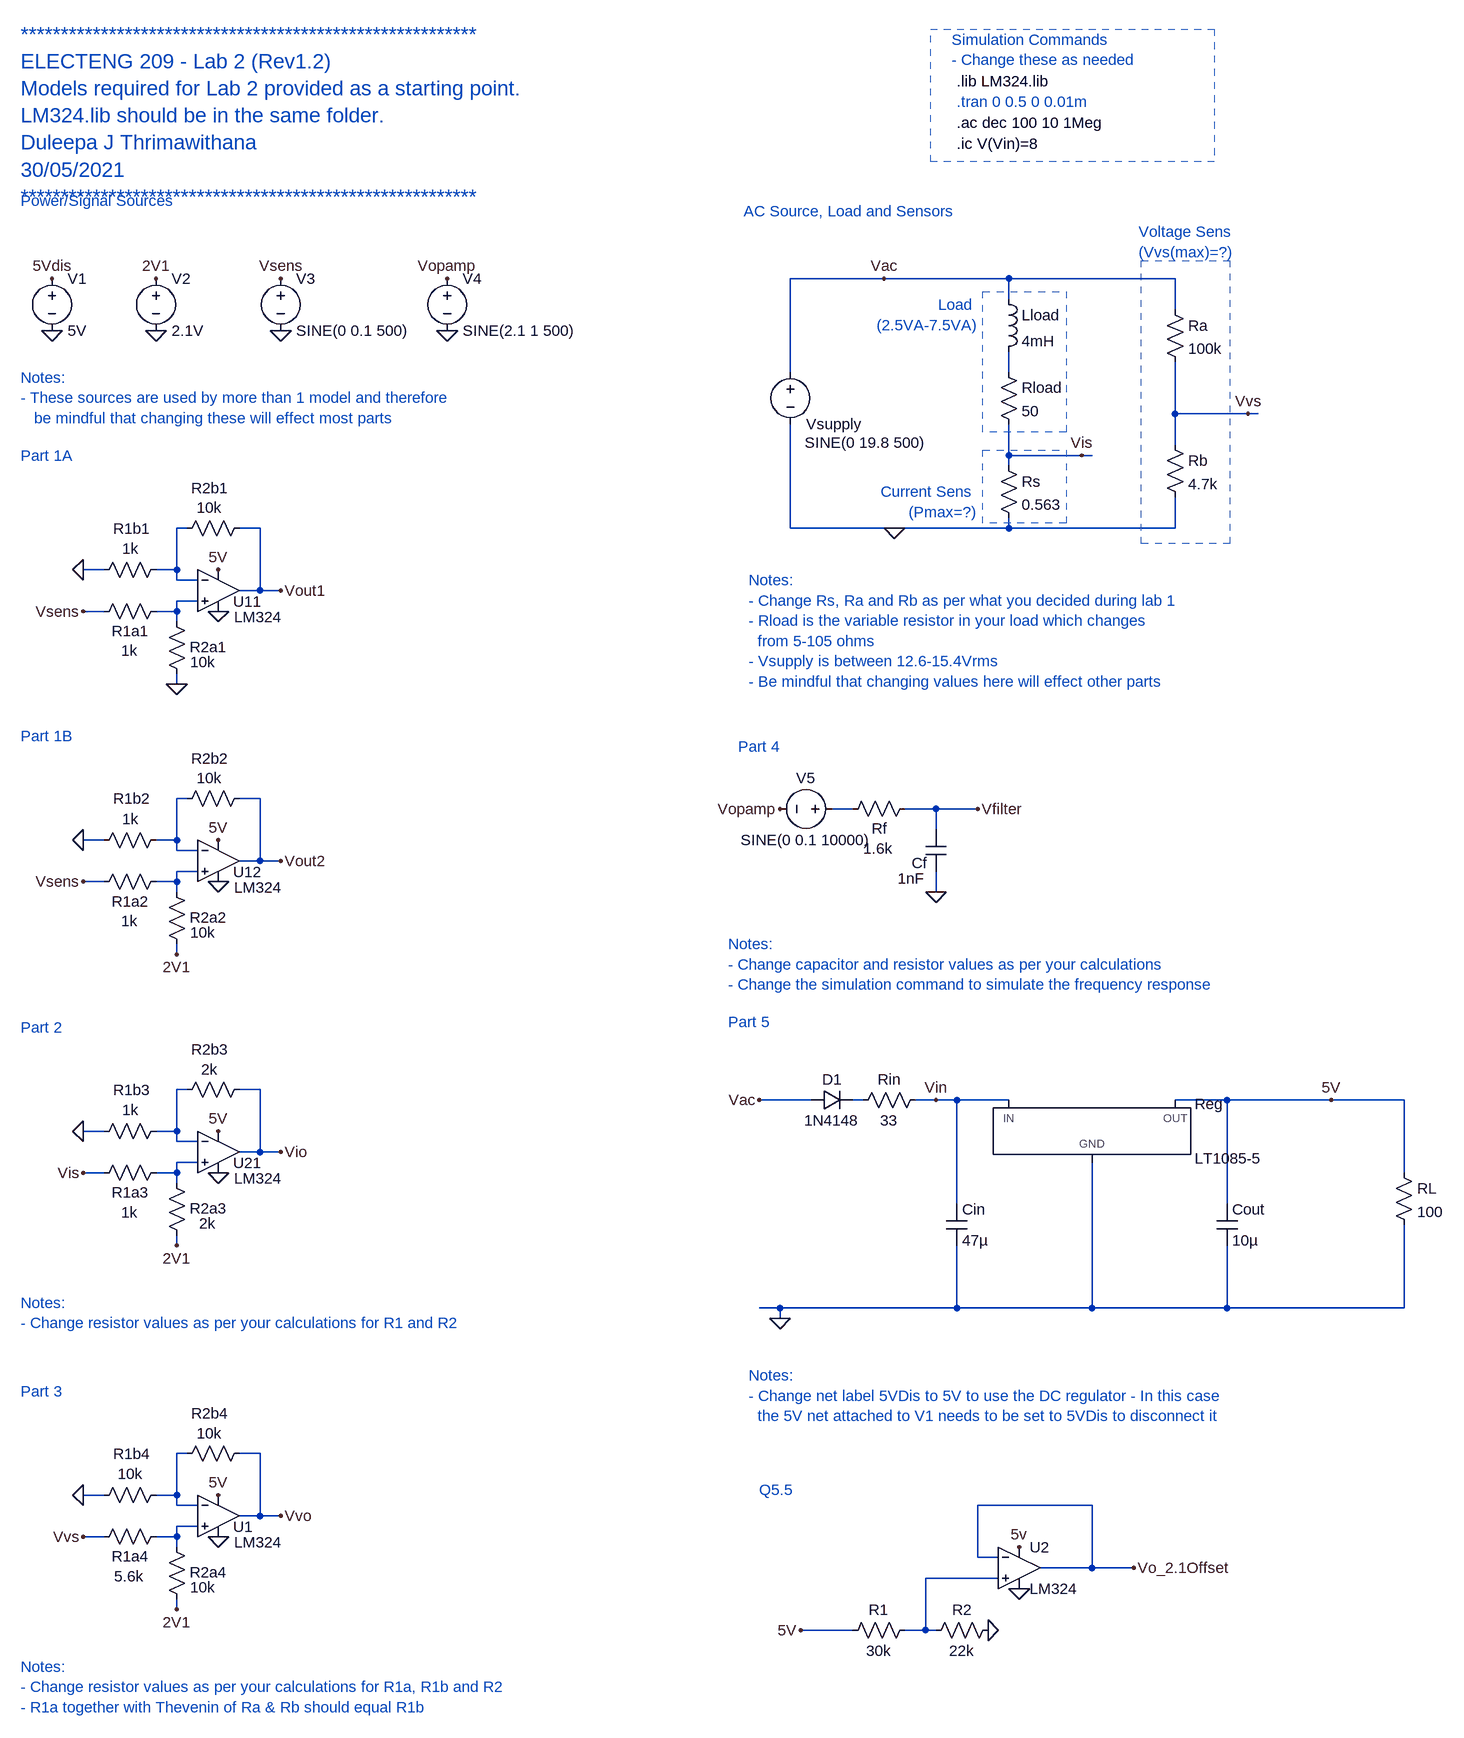
[diagram p0: schematic Lab3_SignCond.asc]
Lab3_SignCond.asc, the LTspice schematic file:
Version 4.1
SHEET 1 1984 2980
WIRE 544 160 400 160
WIRE 736 160 544 160
WIRE 992 160 736 160
WIRE 736 192 736 160
WIRE 992 208 992 160
WIRE 400 304 400 160
WIRE 736 304 736 272
WIRE 992 368 992 288
WIRE 1104 368 992 368
WIRE 1120 368 1104 368
WIRE 992 416 992 368
WIRE 736 432 736 384
WIRE 848 432 736 432
WIRE 864 432 848 432
WIRE 736 448 736 432
WIRE -528 544 -544 544
WIRE -416 544 -448 544
WIRE 400 544 400 384
WIRE 560 544 400 544
WIRE 736 544 736 528
WIRE 736 544 560 544
WIRE 992 544 992 496
WIRE 992 544 736 544
WIRE -656 608 -688 608
WIRE -544 608 -544 544
WIRE -544 608 -576 608
WIRE -544 624 -544 608
WIRE -512 624 -544 624
WIRE -416 640 -416 544
WIRE -416 640 -448 640
WIRE -384 640 -416 640
WIRE -512 656 -544 656
WIRE -656 672 -688 672
WIRE -544 672 -544 656
WIRE -544 672 -576 672
WIRE -544 688 -544 672
WIRE -544 784 -544 768
WIRE -528 960 -544 960
WIRE -416 960 -448 960
WIRE 496 976 464 976
WIRE 624 976 576 976
WIRE 688 976 624 976
WIRE 624 1008 624 976
WIRE -656 1024 -688 1024
WIRE -544 1024 -544 960
WIRE -544 1024 -576 1024
WIRE -544 1040 -544 1024
WIRE -512 1040 -544 1040
WIRE -416 1056 -416 960
WIRE -416 1056 -448 1056
WIRE -384 1056 -416 1056
WIRE -512 1072 -544 1072
WIRE -656 1088 -688 1088
WIRE -544 1088 -544 1072
WIRE -544 1088 -576 1088
WIRE -544 1104 -544 1088
WIRE 624 1104 624 1072
WIRE -544 1200 -544 1184
WIRE -528 1408 -544 1408
WIRE -416 1408 -448 1408
WIRE 432 1424 352 1424
WIRE 512 1424 496 1424
WIRE 624 1424 592 1424
WIRE 656 1424 624 1424
WIRE 736 1424 656 1424
WIRE 1072 1424 992 1424
WIRE 1232 1424 1072 1424
WIRE 1344 1424 1232 1424
WIRE -656 1472 -688 1472
WIRE -544 1472 -544 1408
WIRE -544 1472 -576 1472
WIRE -544 1488 -544 1472
WIRE -512 1488 -544 1488
WIRE -416 1504 -416 1408
WIRE -416 1504 -448 1504
WIRE -384 1504 -416 1504
WIRE -512 1520 -544 1520
WIRE -656 1536 -688 1536
WIRE -544 1536 -544 1520
WIRE -544 1536 -576 1536
WIRE 1344 1536 1344 1424
WIRE -544 1552 -544 1536
WIRE 656 1584 656 1424
WIRE 1072 1584 1072 1424
WIRE -544 1648 -544 1632
WIRE 384 1744 352 1744
WIRE 656 1744 656 1648
WIRE 656 1744 384 1744
WIRE 864 1744 864 1520
WIRE 864 1744 656 1744
WIRE 1072 1744 1072 1648
WIRE 1072 1744 864 1744
WIRE 1344 1744 1344 1616
WIRE 1344 1744 1072 1744
WIRE 384 1760 384 1744
WIRE -528 1968 -544 1968
WIRE -416 1968 -448 1968
WIRE -656 2032 -688 2032
WIRE -544 2032 -544 1968
WIRE -544 2032 -576 2032
WIRE -544 2048 -544 2032
WIRE -512 2048 -544 2048
WIRE 864 2048 688 2048
WIRE -416 2064 -416 1968
WIRE -416 2064 -448 2064
WIRE -384 2064 -416 2064
WIRE -512 2080 -544 2080
WIRE -656 2096 -688 2096
WIRE -544 2096 -544 2080
WIRE -544 2096 -576 2096
WIRE -544 2112 -544 2096
WIRE 688 2128 688 2048
WIRE 720 2128 688 2128
WIRE 864 2144 864 2048
WIRE 864 2144 784 2144
WIRE 928 2144 864 2144
WIRE 720 2160 608 2160
WIRE -544 2208 -544 2192
WIRE 496 2240 416 2240
WIRE 608 2240 608 2160
WIRE 608 2240 576 2240
WIRE 624 2240 608 2240
FLAG -736 240 0
FLAG -480 672 0
FLAG 560 544 0
FLAG -736 160 5Vdis
FLAG -480 608 5V
FLAG 544 160 Vac
FLAG -688 672 Vsens
FLAG 384 1760 0
FLAG -544 784 0
FLAG -688 608 0
FLAG -384 640 Vout1
FLAG -576 240 0
FLAG -480 1088 0
FLAG -576 160 2V1
FLAG -480 1024 5V
FLAG -688 1088 Vsens
FLAG -688 1024 0
FLAG -384 1056 Vout2
FLAG -544 1200 2V1
FLAG -384 240 0
FLAG -384 160 Vsens
FLAG 848 432 Vis
FLAG 1104 368 Vvs
FLAG -480 1536 0
FLAG -480 1472 5V
FLAG -688 1536 Vis
FLAG -688 1472 0
FLAG -384 1504 Vio
FLAG -544 1648 2V1
FLAG -480 2096 0
FLAG -480 2032 5V
FLAG -688 2096 Vvs
FLAG -688 2032 0
FLAG -384 2064 Vvo
FLAG -544 2208 2V1
FLAG 352 1424 Vac
FLAG 1232 1424 5V
FLAG 624 1104 0
FLAG 688 976 Vfilter
FLAG -128 240 0
FLAG -128 160 Vopamp
FLAG 624 1424 Vin
FLAG 384 976 Vopamp
FLAG 416 2240 5V
FLAG 928 2144 Vo_2.1Offset
FLAG 752 2112 5v
FLAG 752 2176 0
FLAG 704 2240 0
SYMBOL Opamps/opamp2 -480 576 R0
WINDOW 0 23 81 Left 2
WINDOW 3 24 105 Left 2
SYMATTR InstName U11
SYMATTR Value LM324
SYMBOL voltage -736 144 R0
SYMATTR InstName V1
SYMATTR Value 5V
SYMBOL voltage 400 288 R0
WINDOW 0 24 96 Left 2
WINDOW 3 22 124 Left 2
WINDOW 123 0 0 Left 0
WINDOW 39 0 0 Left 0
SYMATTR InstName Vsupply
SYMATTR Value SINE(0 19.8 500)
SYMBOL PowerProducts/LT1085-5 864 1424 R0
SYMATTR InstName Reg
SYMBOL res 1328 1520 R0
SYMATTR InstName RL
SYMATTR Value 100
SYMBOL res 608 1408 R90
WINDOW 0 0 56 VBottom 2
WINDOW 3 32 56 VTop 2
SYMATTR InstName Rin
SYMATTR Value 33
SYMBOL diode 432 1440 R270
WINDOW 0 32 32 VTop 2
WINDOW 3 0 32 VBottom 2
SYMATTR InstName D1
SYMATTR Value 1N4148
SYMBOL cap 640 1584 R0
SYMATTR InstName Cin
SYMATTR Value 47µ
SYMATTR SpiceLine Rser=0.001
SYMBOL cap 1056 1584 R0
SYMATTR InstName Cout
SYMATTR Value 10µ
SYMATTR SpiceLine Rser=0.001
SYMBOL res -560 656 R90
WINDOW 0 62 55 VBottom 2
WINDOW 3 61 57 VTop 2
SYMATTR InstName R1a1
SYMATTR Value 1k
SYMBOL res -560 592 R90
WINDOW 0 -32 53 VBottom 2
WINDOW 3 -32 55 VTop 2
SYMATTR InstName R1b1
SYMATTR Value 1k
SYMBOL res -432 528 R90
WINDOW 0 -30 61 VBottom 2
WINDOW 3 -31 62 VTop 2
SYMATTR InstName R2b1
SYMATTR Value 10k
SYMBOL res -528 784 R180
WINDOW 0 -62 57 Left 2
WINDOW 3 -44 34 Left 2
SYMATTR InstName R2a1
SYMATTR Value 10k
SYMBOL Opamps/opamp2 -480 992 R0
WINDOW 0 23 81 Left 2
WINDOW 3 24 105 Left 2
SYMATTR InstName U12
SYMATTR Value LM324
SYMBOL voltage -576 144 R0
SYMATTR InstName V2
SYMATTR Value 2.1V
SYMBOL res -560 1072 R90
WINDOW 0 62 55 VBottom 2
WINDOW 3 61 57 VTop 2
SYMATTR InstName R1a2
SYMATTR Value 1k
SYMBOL res -560 1008 R90
WINDOW 0 -32 53 VBottom 2
WINDOW 3 -32 55 VTop 2
SYMATTR InstName R1b2
SYMATTR Value 1k
SYMBOL res -432 944 R90
WINDOW 0 -30 61 VBottom 2
WINDOW 3 -31 62 VTop 2
SYMATTR InstName R2b2
SYMATTR Value 10k
SYMBOL res -528 1200 R180
WINDOW 0 -62 57 Left 2
WINDOW 3 -44 34 Left 2
SYMATTR InstName R2a2
SYMATTR Value 10k
SYMBOL voltage -384 144 R0
WINDOW 39 0 0 Left 0
SYMATTR InstName V3
SYMATTR Value SINE(0 0.1 500)
SYMATTR Value2 AC .1 0
SYMBOL res 720 288 R0
SYMATTR InstName Rload
SYMATTR Value 50
SYMBOL ind 720 176 R0
SYMATTR InstName Lload
SYMATTR Value 4mH
SYMBOL res 720 432 R0
SYMATTR InstName Rs
SYMATTR Value 0.563
SYMBOL res 976 192 R0
SYMATTR InstName Ra
SYMATTR Value 100k
SYMBOL res 976 400 R0
SYMATTR InstName Rb
SYMATTR Value 4.7k
SYMBOL Opamps/opamp2 -480 1440 R0
WINDOW 0 23 81 Left 2
WINDOW 3 24 105 Left 2
SYMATTR InstName U21
SYMATTR Value LM324
SYMBOL res -560 1520 R90
WINDOW 0 62 55 VBottom 2
WINDOW 3 61 57 VTop 2
SYMATTR InstName R1a3
SYMATTR Value 1k
SYMBOL res -560 1456 R90
WINDOW 0 -32 53 VBottom 2
WINDOW 3 -32 55 VTop 2
SYMATTR InstName R1b3
SYMATTR Value 1k
SYMBOL res -432 1392 R90
WINDOW 0 -30 61 VBottom 2
WINDOW 3 -31 62 VTop 2
SYMATTR InstName R2b3
SYMATTR Value 2k
SYMBOL res -528 1648 R180
WINDOW 0 -62 57 Left 2
WINDOW 3 -44 34 Left 2
SYMATTR InstName R2a3
SYMATTR Value 2k
SYMBOL Opamps/opamp2 -480 2000 R0
WINDOW 0 23 81 Left 2
WINDOW 3 24 105 Left 2
SYMATTR InstName U1
SYMATTR Value LM324
SYMBOL res -560 2080 R90
WINDOW 0 62 55 VBottom 2
WINDOW 3 61 57 VTop 2
SYMATTR InstName R1a4
SYMATTR Value 5.6k
SYMBOL res -560 2016 R90
WINDOW 0 -32 53 VBottom 2
WINDOW 3 -32 55 VTop 2
SYMATTR InstName R1b4
SYMATTR Value 10k
SYMBOL res -432 1952 R90
WINDOW 0 -30 61 VBottom 2
WINDOW 3 -31 62 VTop 2
SYMATTR InstName R2b4
SYMATTR Value 10k
SYMBOL res -528 2208 R180
WINDOW 0 -62 57 Left 2
WINDOW 3 -44 34 Left 2
SYMATTR InstName R2a4
SYMATTR Value 10k
SYMBOL res 592 960 R90
WINDOW 0 62 55 VBottom 2
WINDOW 3 61 57 VTop 2
SYMATTR InstName Rf
SYMATTR Value 1.6k
SYMBOL cap 640 1072 R180
WINDOW 0 29 13 Left 2
WINDOW 3 33 -11 Left 2
SYMATTR InstName Cf
SYMATTR Value 1nF
SYMBOL voltage -128 144 R0
WINDOW 39 0 0 Left 0
SYMATTR InstName V4
SYMATTR Value SINE(2.1 1 500)
SYMATTR Value2 AC 1 0
SYMBOL voltage 480 976 R90
WINDOW 0 -32 56 VBottom 2
WINDOW 3 32 56 VTop 2
WINDOW 123 0 0 Left 0
WINDOW 39 0 0 Left 0
SYMATTR InstName V5
SYMATTR Value SINE(0 0.1 10000)
SYMBOL res 592 2224 R90
WINDOW 0 0 56 VBottom 2
WINDOW 3 32 56 VTop 2
SYMATTR InstName R1
SYMATTR Value 30k
SYMBOL res 720 2224 R90
WINDOW 0 0 56 VBottom 2
WINDOW 3 32 56 VTop 2
SYMATTR InstName R2
SYMATTR Value 22k
SYMBOL OpAmps\\opamp2 752 2080 R0
SYMATTR InstName U2
SYMATTR Value LM324
TEXT 656 -80 Left 2 !.ac dec 100 10 1Meg
TEXT 656 -144 Left 2 !.lib LM324.lib
TEXT -784 432 Left 2 ;Part 1A
TEXT -784 864 Left 2 ;Part 1B
TEXT -784 40 Left 2 ;Power/Signal Sources
TEXT -784 -216 Left 3 ;*********************************************************\nELECTENG 209 - Lab 2 (Rev1.2)\nModels required for Lab 2 provided as a starting point.\nLM324.lib should be in the same folder.\nDuleepa J Thrimawithana\n30/05/2021\n*********************************************************
TEXT 328 56 Left 2 ;AC Source, Load and Sensors
TEXT -784 312 Left 2 ;Notes: \n- These sources are used by more than 1 model and therefore\n   be mindful that changing these will effect most parts
TEXT 336 624 Left 2 ;Notes: \n- Change Rs, Ra and Rb as per what you decided during lab 1\n- Rload is the variable resistor in your load which changes \n  from 5-105 ohms \n- Vsupply is between 12.6-15.4Vrms\n- Be mindful that changing values here will effect other parts
TEXT 688 200 Right 2 ;Load \n(2.5VA-7.5VA)
TEXT 688 488 Right 2 ;Current Sens \n(Pmax=?)
TEXT 936 88 Left 2 ;Voltage Sens\n(Vvs(max)=?)
TEXT 648 -208 Left 2 ;Simulation Commands\n- Change these as needed
TEXT -784 1312 Left 2 ;Part 2
TEXT -784 1736 Left 2 ;Notes: \n- Change resistor values as per your calculations for R1 and R2
TEXT -784 1872 Left 2 ;Part 3
TEXT -784 2296 Left 2 ;Notes: \n- Change resistor values as per your calculations for R1a, R1b and R2\n- R1a together with Thevenin of Ra & Rb should equal R1b
TEXT 304 1304 Left 2 ;Part 5
TEXT 320 880 Left 2 ;Part 4
TEXT 304 1184 Left 2 ;Notes: \n- Change capacitor and resistor values as per your calculations\n- Change the simulation command to simulate the frequency response
TEXT 656 -112 Left 2 ;.tran 0 0.5 0 0.01m
TEXT 656 -48 Left 2 !.ic V(Vin)=8
TEXT 336 1848 Left 2 ;Notes: \n- Change net label 5VDis to 5V to use the DC regulator - In this case \n  the 5V net attached to V1 needs to be set to 5VDis to disconnect it
TEXT 352 2024 Left 2 ;Q5.5
RECTANGLE Normal 696 180 824 396 2
RECTANGLE Normal 696 424 824 536 2
RECTANGLE Normal 940 132 1076 568 2
RECTANGLE Normal 616 -224 1052 -20 2

The netlist it stands for:
* Lab3_SignCond.asc
X§U11 N003 N002 5V 0 Vout1 LM324  ; pins In+ In- V+ V- OUT
V1 5Vdis 0 5V
Vsupply Vac 0 SINE(0 19.8 500)
X§Reg 0 5V Vin LT1085-5  ; pins GND OUT IN
RL 5V 0 100
Rin Vin N008 33
D1 Vac N008 1N4148
Cin Vin 0 47µ Rser=0.001
Cout 5V 0 10µ Rser=0.001
R1a1 N003 Vsens 1k
R1b1 N002 0 1k
R2b1 Vout1 N002 10k
R2a1 0 N003 10k
X§U12 N006 N004 5V 0 Vout2 LM324  ; pins In+ In- V+ V- OUT
V2 2V1 0 2.1V
R1a2 N006 Vsens 1k
R1b2 N004 0 1k
R2b2 Vout2 N004 10k
R2a2 2V1 N006 10k
V3 Vsens 0 SINE(0 0.1 500) AC .1 0
Rload N001 Vis 50
Lload Vac N001 4mH
Rs Vis 0 0.563
Ra Vac Vvs 100k
Rb Vvs 0 4.7k
X§U21 N009 N007 5V 0 Vio LM324  ; pins In+ In- V+ V- OUT
R1a3 N009 Vis 1k
R1b3 N007 0 1k
R2b3 Vio N007 2k
R2a3 2V1 N009 2k
X§U1 N011 N010 5V 0 Vvo LM324  ; pins In+ In- V+ V- OUT
R1a4 N011 Vvs 5.6k
R1b4 N010 0 10k
R2b4 Vvo N010 10k
R2a4 2V1 N011 10k
Rf Vfilter N005 1.6k
Cf 0 Vfilter 1nF
V4 Vopamp 0 SINE(2.1 1 500) AC 1 0
V5 N005 Vopamp SINE(0 0.1 10000)
R1 N012 5V 30k
R2 0 N012 22k
X§U2 N012 Vo_2.1Offset 5V 0 Vo_2.1Offset LM324  ; pins In+ In- V+ V- OUT
.model D D
.lib standard.dio
.ac dec 100 10 1Meg
.lib LM324.lib
* Part 1A
* Part 1B
* Power/Signal Sources
* *********************************************************
* ELECTENG 209 - Lab 2 (Rev1.2)
* Models required for Lab 2 provided as a starting point.
* LM324.lib should be in the same folder.
* Duleepa J Thrimawithana
* 30/05/2021
* *********************************************************
* AC Source, Load and Sensors
* Notes:
* - These sources are used by more than 1 model and therefore
*    be mindful that changing these will effect most parts
* Notes:
* - Change Rs, Ra and Rb as per what you decided during lab 1
* - Rload is the variable resistor in your load which changes
*   from 5-105 ohms
* - Vsupply is between 12.6-15.4Vrms
* - Be mindful that changing values here will effect other parts
* Load
* (2.5VA-7.5VA)
* Current Sens
* (Pmax=?)
* Voltage Sens
* (Vvs(max)=?)
* Simulation Commands
* - Change these as needed
* Part 2
* Notes:
* - Change resistor values as per your calculations for R1 and R2
* Part 3
* Notes:
* - Change resistor values as per your calculations for R1a, R1b and R2
* - R1a together with Thevenin of Ra & Rb should equal R1b
* Part 5
* Part 4
* Notes:
* - Change capacitor and resistor values as per your calculations
* - Change the simulation command to simulate the frequency response
* .tran 0 0.5 0 0.01m
.ic V(Vin)=8
* Notes:
* - Change net label 5VDis to 5V to use the DC regulator - In this case
*   the 5V net attached to V1 needs to be set to 5VDis to disconnect it
* Q5.5
.backanno
.end